# EAGLE schematic lm709_PCB (EAGLE 9.5.2)

## Sheet 1 of 2
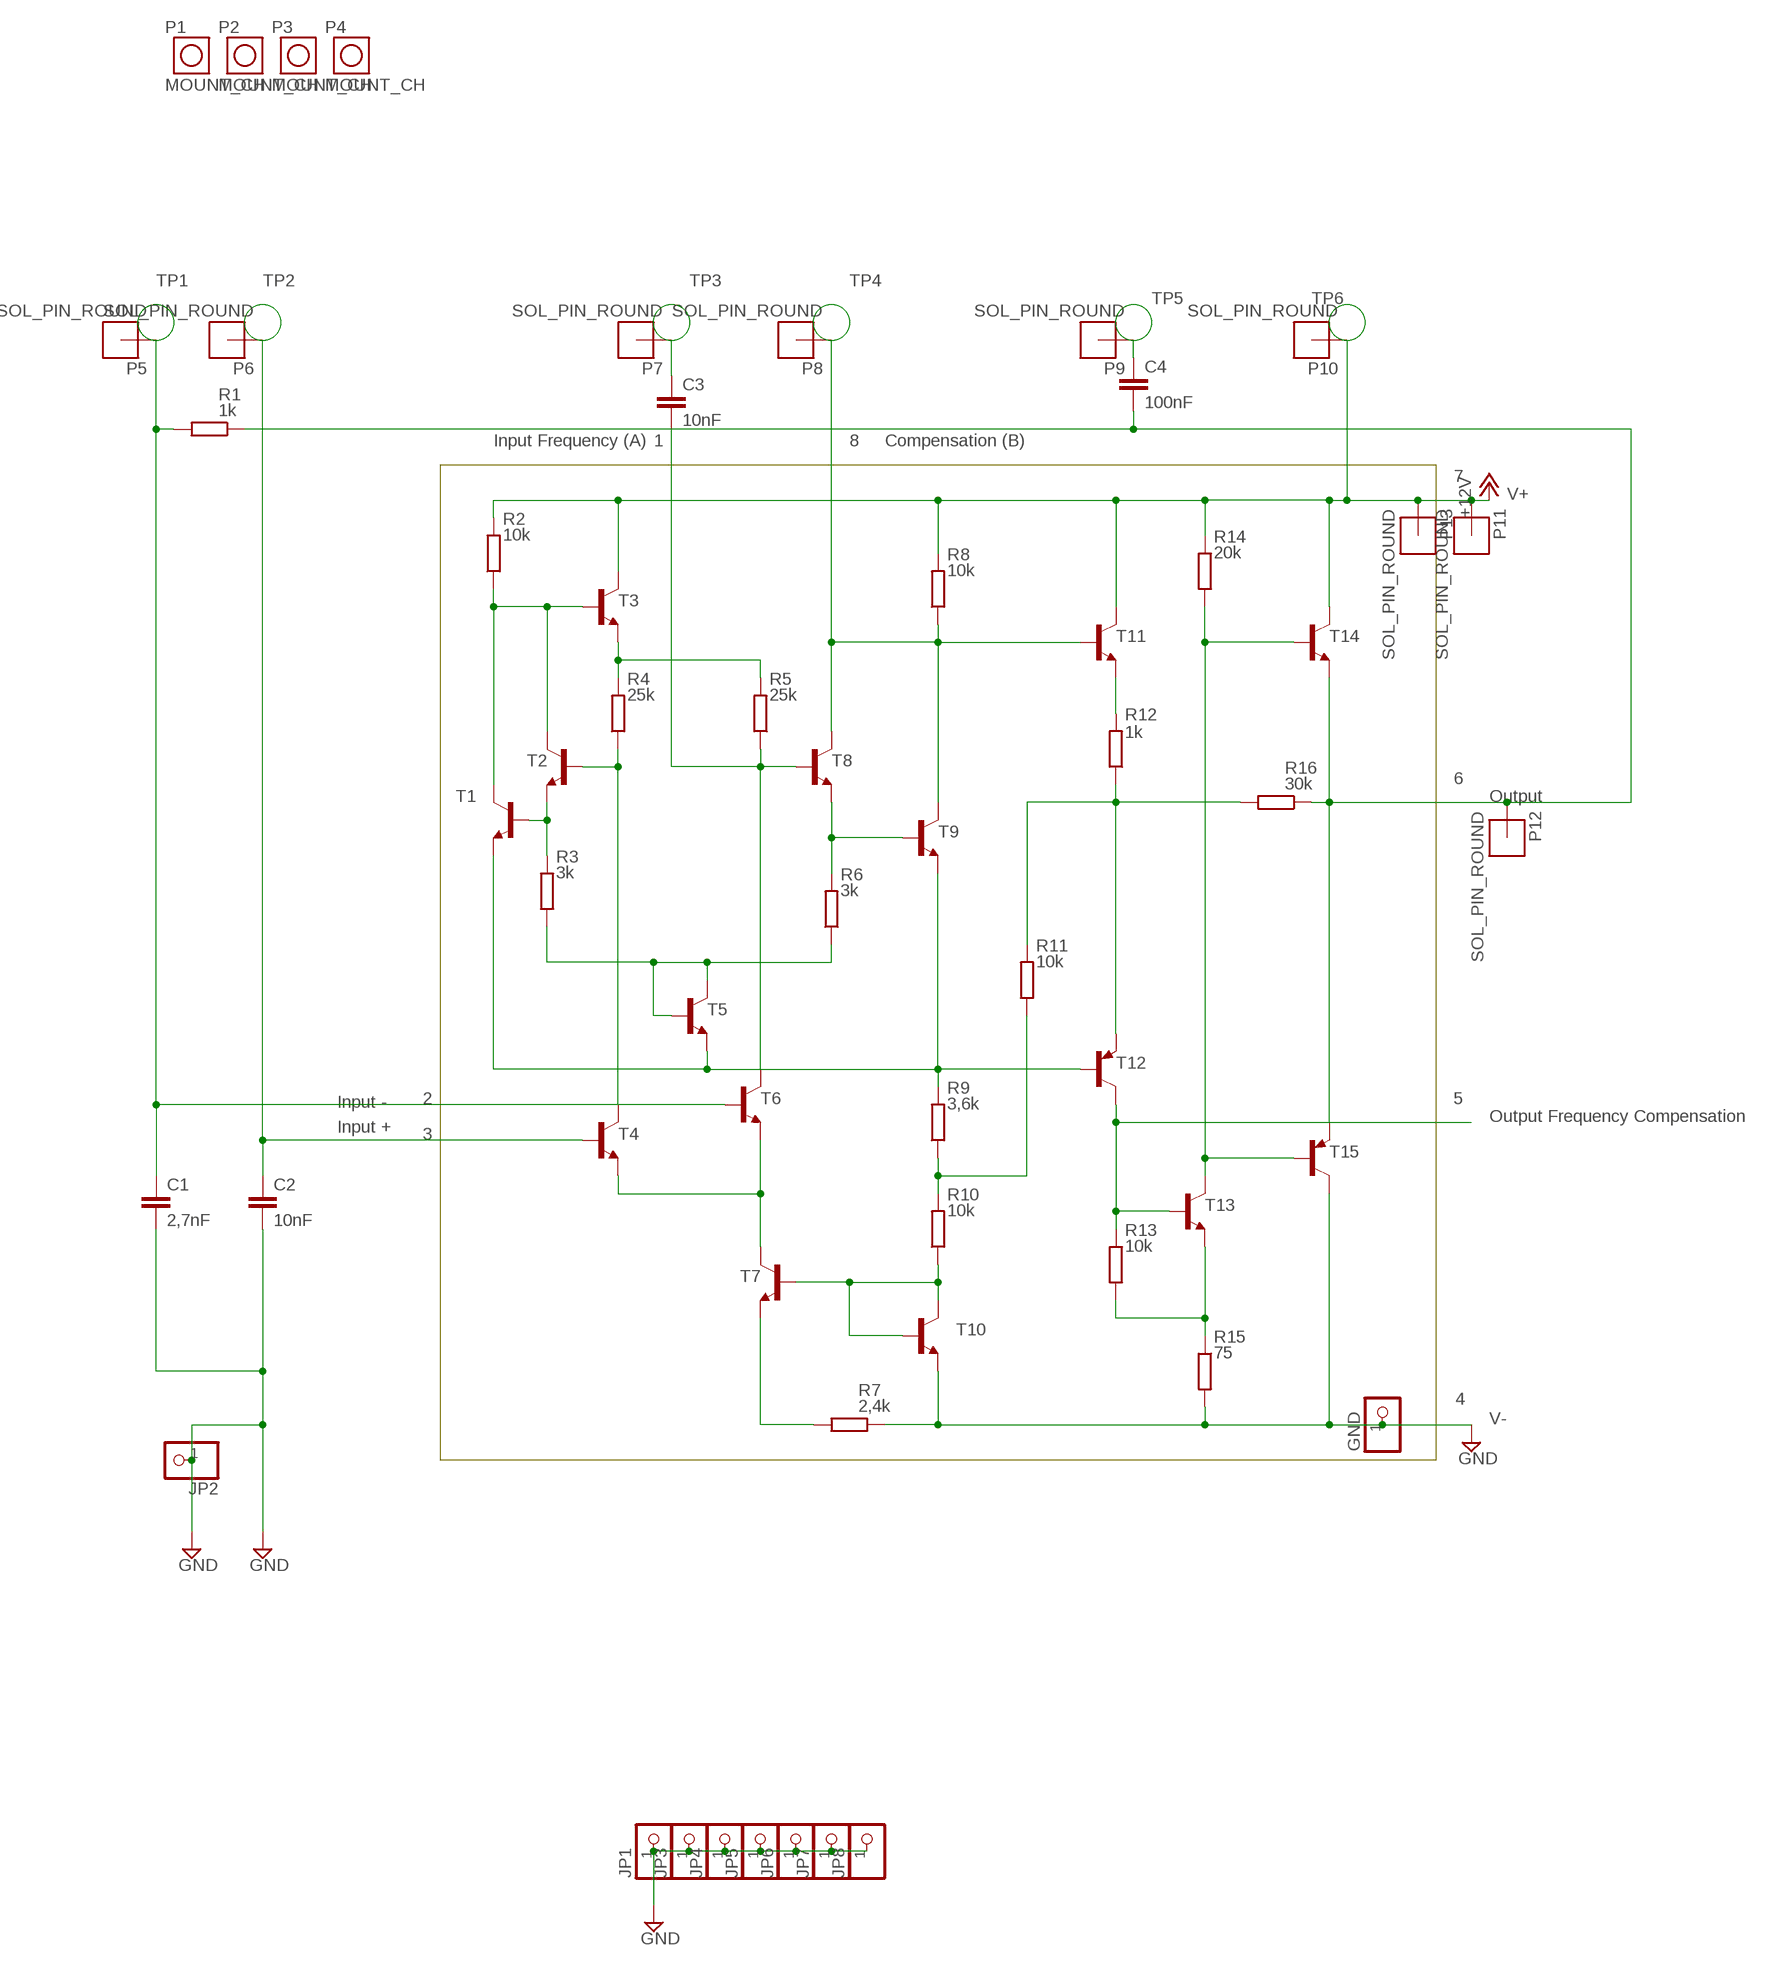
[diagram p0: schematic, sheet 1]

### Parts
C1  2,7nF  C-EU050-024X044  [C050-024X044]
C2  10nF  C-EU050-024X044  [C050-024X044]
C3  10nF  C-EU050-024X044  [C050-024X044]
C4  100nF  C-EU050-024X044  [C050-024X044]
GND  PINHD-1X1  [1X01]
JP1  PINHD-1X1  [1X01]
JP2  PINHD-1X1  [1X01]
JP3  PINHD-1X1  [1X01]
JP4  PINHD-1X1  [1X01]
JP5  PINHD-1X1  [1X01]
JP6  PINHD-1X1  [1X01]
JP7  PINHD-1X1  [1X01]
JP8  PINHD-1X1  [1X01]
P1  MOUNT_CH  [MOUNT_CH32]
P2  MOUNT_CH  [MOUNT_CH32]
P3  MOUNT_CH  [MOUNT_CH32]
P4  MOUNT_CH  [MOUNT_CH32]
P5  SOL_PIN_ROUND  [SOL_PAD_ROUND]
P6  SOL_PIN_ROUND  [SOL_PAD_ROUND]
P7  SOL_PIN_ROUND  [SOL_PAD_ROUND]
P8  SOL_PIN_ROUND  [SOL_PAD_ROUND]
P9  SOL_PIN_ROUND  [SOL_PAD_ROUND]
P10  SOL_PIN_ROUND  [SOL_PAD_ROUND]
P11  SOL_PIN_ROUND  [SOL_PAD_ROUND]
P12  SOL_PIN_ROUND  [SOL_PAD_ROUND]
P13  SOL_PIN_ROUND  [SOL_PAD_ROUND]
R1  1k  R-EU_0207/10  [0207/10]
R2  10k  R-EU_0207/10  [0207/10]
R3  3k  R-EU_0207/10  [0207/10]
R4  25k  R-EU_0207/10  [0207/10]
R5  25k  R-EU_0207/10  [0207/10]
R6  3k  R-EU_0207/10  [0207/10]
R7  2,4k  R-EU_0207/10  [0207/10]
R8  10k  R-EU_0207/10  [0207/10]
R9  3,6k  R-EU_0207/10  [0207/10]
R10  10k  R-EU_0207/10  [0207/10]
R11  10k  R-EU_0207/10  [0207/10]
R12  1k  R-EU_0207/10  [0207/10]
R13  10k  R-EU_0207/10  [0207/10]
R14  20k  R-EU_0207/10  [0207/10]
R15  75  R-EU_0207/10  [0207/10]
R16  30k  R-EU_0207/10  [0207/10]
T1  2N3904-NPN-TO92-EBC  [TO92-EBC]
T2  2N3904-NPN-TO92-EBC  [TO92-EBC]
T3  2N3904-NPN-TO92-EBC  [TO92-EBC]
T4  2N3904-NPN-TO92-EBC  [TO92-EBC]
T5  2N3904-NPN-TO92-EBC  [TO92-EBC]
T6  2N3904-NPN-TO92-EBC  [TO92-EBC]
T7  2N3904-NPN-TO92-EBC  [TO92-EBC]
T8  2N3904-NPN-TO92-EBC  [TO92-EBC]
T9  2N3904-NPN-TO92-EBC  [TO92-EBC]
T10  2N3904-NPN-TO92-EBC  [TO92-EBC]
T11  2N3904-NPN-TO92-EBC  [TO92-EBC]
T12  2N3906-PNP-TO92-EBC  [TO92-EBC]
T13  2N3904-NPN-TO92-EBC  [TO92-EBC]
T14  2N3904-NPN-TO92-EBC  [TO92-EBC]
T15  2N3906-PNP-TO92-EBC  [TO92-EBC]

### Nets
+12V: P10.1 P11.1 P13.1 R2.2 R8.2 R14.2 T3.C T11.C T14.C
GND: C1.2 C2.2 GND.1 JP1.1 JP2.1 JP3.1 JP4.1 JP5.1 JP6.1 JP7.1 JP8.1 R7.1 R15.2 T10.E T15.C
N$1: R3.2 T1.B T2.E
N$2: R4.1 T2.B T4.C
N$3: R4.2 R5.2 T3.E
N$4: R2.1 T1.C T2.C T3.B
N$6: R6.2 T8.E T9.B
N$7: C3.2 R5.1 T6.C T8.B
N$8: R3.1 R6.1 T5.B T5.C
N$9: R9.2 T1.E T5.E T9.E T12.B
N$10: R14.1 T13.C T14.B T15.B
N$11: C2.1 P6.1 T4.B
N$12: C1.1 P5.1 R1.2 T6.B
N$13: T4.E T6.E T7.C
N$14: R7.2 T7.E
N$16: R10.1 T7.B T10.B T10.C
N$17: R9.1 R10.2 R11.1
N$18: P8.1 R8.1 T8.C T9.C T11.B
N$19: R13.1 T12.C T13.B
N$20: C4.2 P12.1 R1.1 R16.1 T14.E T15.E
N$21: R11.2 R12.1 R16.2 T12.E
N$22: R12.2 T11.E
N$24: R13.2 R15.1 T13.E
N$56: C3.1 P7.1
N$57: C4.1 P9.1
Unconnected: P1.P$1 P2.P$1 P3.P$1 P4.P$1

### Notes on the sheet
- TP1 | TP2 | TP3 | TP4
- TP5 | TP6
- Input Frequency (A) | 1 | 8 | Compensation (B)
- 7
- V+
- 6
- Output
- Input - | 2 | 5
- Output Frequency Compensation
- Input +
- 3
- 4
- V-

## Sheet 2 of 2

## Library data of the parts
C1-C4 = rcl:C-EU: CAPACITOR, European symbol; SPICEPREFIX: C
GND JP2 = pinhead:PINHD-1X1: PIN HEADER
JP1 JP3-JP8 = pinhead01:PINHD-1X1: PIN HEADER
P1-P4 = sol_pin:MOUNT_CH: mounting hole 3,2 mm M3
P5-P13 = sol_pin:SOL_PIN_ROUND
R1-R16 = rcl:R-EU_: RESISTOR, European symbol; SPICEPREFIX: R
T1-T11 T13 T14 = transistor-neu-to92:*-NPN-: NPN Transistror
T12 T15 = transistor-neu-to92:*-PNP-: PNP Transistror